# EAGLE design board_ätzen (EAGLE 6.5.0)
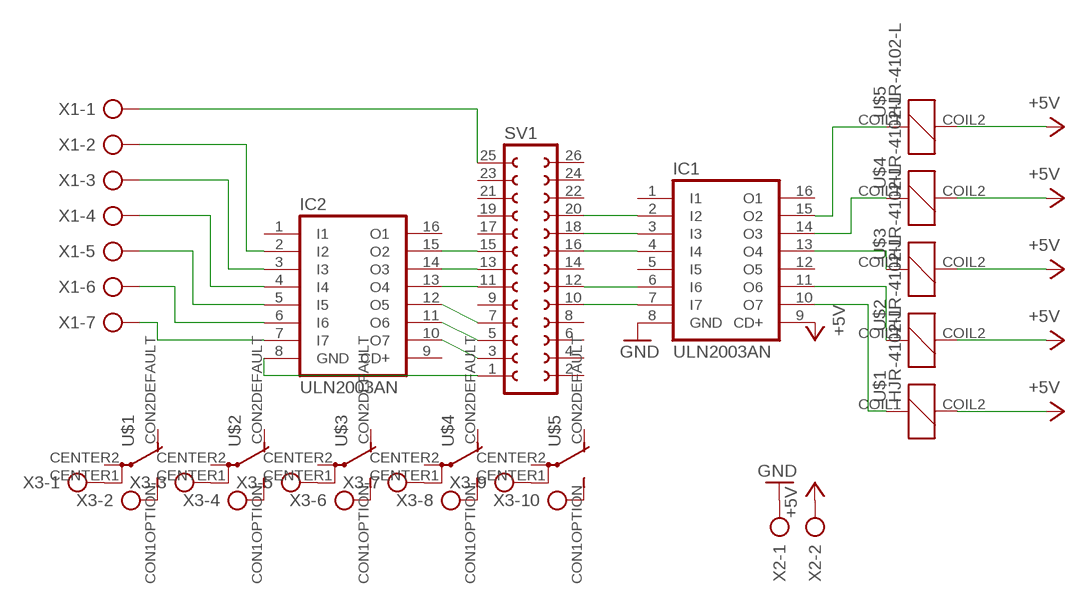
[diagram p0: schematic, sheet 1]

## Parts
IC1  ULN2003AN  [DIL16]
IC2  ULN2003AN  [DIL16]
SV1  FE13-2  [FE13-2]
U$1  HJR-4102-L  [HJR4102]
U$2  HJR-4102-L  [HJR4102]
U$3  HJR-4102-L  [HJR4102]
U$4  HJR-4102-L  [HJR4102]
U$5  HJR-4102-L  [HJR4102]
X1  AK500/7  [AK500/7]
X2  AK500/2  [AK500/2]
X3  AK500/10  [AK500/10]

## Nets
+5V: IC1.9(CD+) U$1.COIL2 U$2.COIL2 U$3.COIL2 U$4.COIL2 U$5.COIL2 X2.2
GND: IC1.8(GND) X2.1
N$1: IC2.8(GND) SV1.1
N$2: IC2.10(O7) SV1.3
N$3: IC2.11(O6) SV1.5
N$4: IC2.12(O5) SV1.7
N$5: IC2.13(O4) SV1.11
N$6: IC2.14(O3) SV1.13
N$7: IC2.15(O2) SV1.15
N$8: SV1.25 X1.1
N$9: IC2.2(I2) X1.2
N$10: IC2.3(I3) X1.3
N$11: IC2.4(I4) X1.4
N$12: IC2.5(I5) X1.5
N$13: IC2.6(I6) X1.6
N$14: IC2.7(I7) X1.7
N$15: IC1.7(I7) SV1.10
N$16: IC1.6(I6) SV1.12
N$17: IC1.2(I2) SV1.20
N$18: IC1.4(I4) SV1.16
N$19: IC1.15(O2) U$5.COIL1
N$20: IC1.14(O3) U$4.COIL1
N$21: IC1.13(O4) U$3.COIL1
N$22: U$4.CENTER1(P) X3.7
N$23: U$3.CON1OPTION(S) X3.6
N$24: IC1.11(O6) U$2.COIL1
N$25: U$5.CENTER1(P) X3.9
N$26: U$4.CON1OPTION(S) X3.8
N$27: U$3.CENTER1(P) X3.5
N$28: U$2.CON1OPTION(S) X3.4
N$29: IC1.3(I3) SV1.18
N$30: IC1.10(O7) U$1.COIL1
N$31: U$2.CENTER1(P) X3.3
N$32: U$1.CON1OPTION(S) X3.2
N$33: U$1.CENTER1(P) X3.1
N$34: U$5.CON1OPTION(S) X3.10
Unconnected: IC1.1(I1) IC1.5(I5) IC1.12(O5) IC1.16(O1) IC2.1(I1) IC2.9(CD+) IC2.16(O1) SV1.2 SV1.4 SV1.6 SV1.8 SV1.9 SV1.14 SV1.17 SV1.19 SV1.21 SV1.22 SV1.23 SV1.24 SV1.26 U$1.CENTER2(P) U$1.CON2DEFAULT(O) U$2.CENTER2(P) U$2.CON2DEFAULT(O) U$3.CENTER2(P) U$3.CON2DEFAULT(O) U$4.CENTER2(P) U$4.CON2DEFAULT(O) U$5.CENTER2(P) U$5.CON2DEFAULT(O)

## Library data of the parts
IC1 IC2 = uln-udn:ULN2003A: DRIVER ARRAY
SV1 = con-lsta:FE13-2: FEMALE HEADER; OC_FARNELL: unknown; OC_NEWARK: unknown
U$1-U$5 = relay:HJR-4102-L
X1 = con-ptr500:AK500/7: CONNECTOR; OC_FARNELL: unknown; OC_NEWARK: unknown
X2 = con-ptr500:AK500/2: CONNECTOR; OC_FARNELL: unknown; OC_NEWARK: unknown
X3 = con-ptr500:AK500/10: CONNECTOR; OC_FARNELL: unknown; OC_NEWARK: unknown

## Board
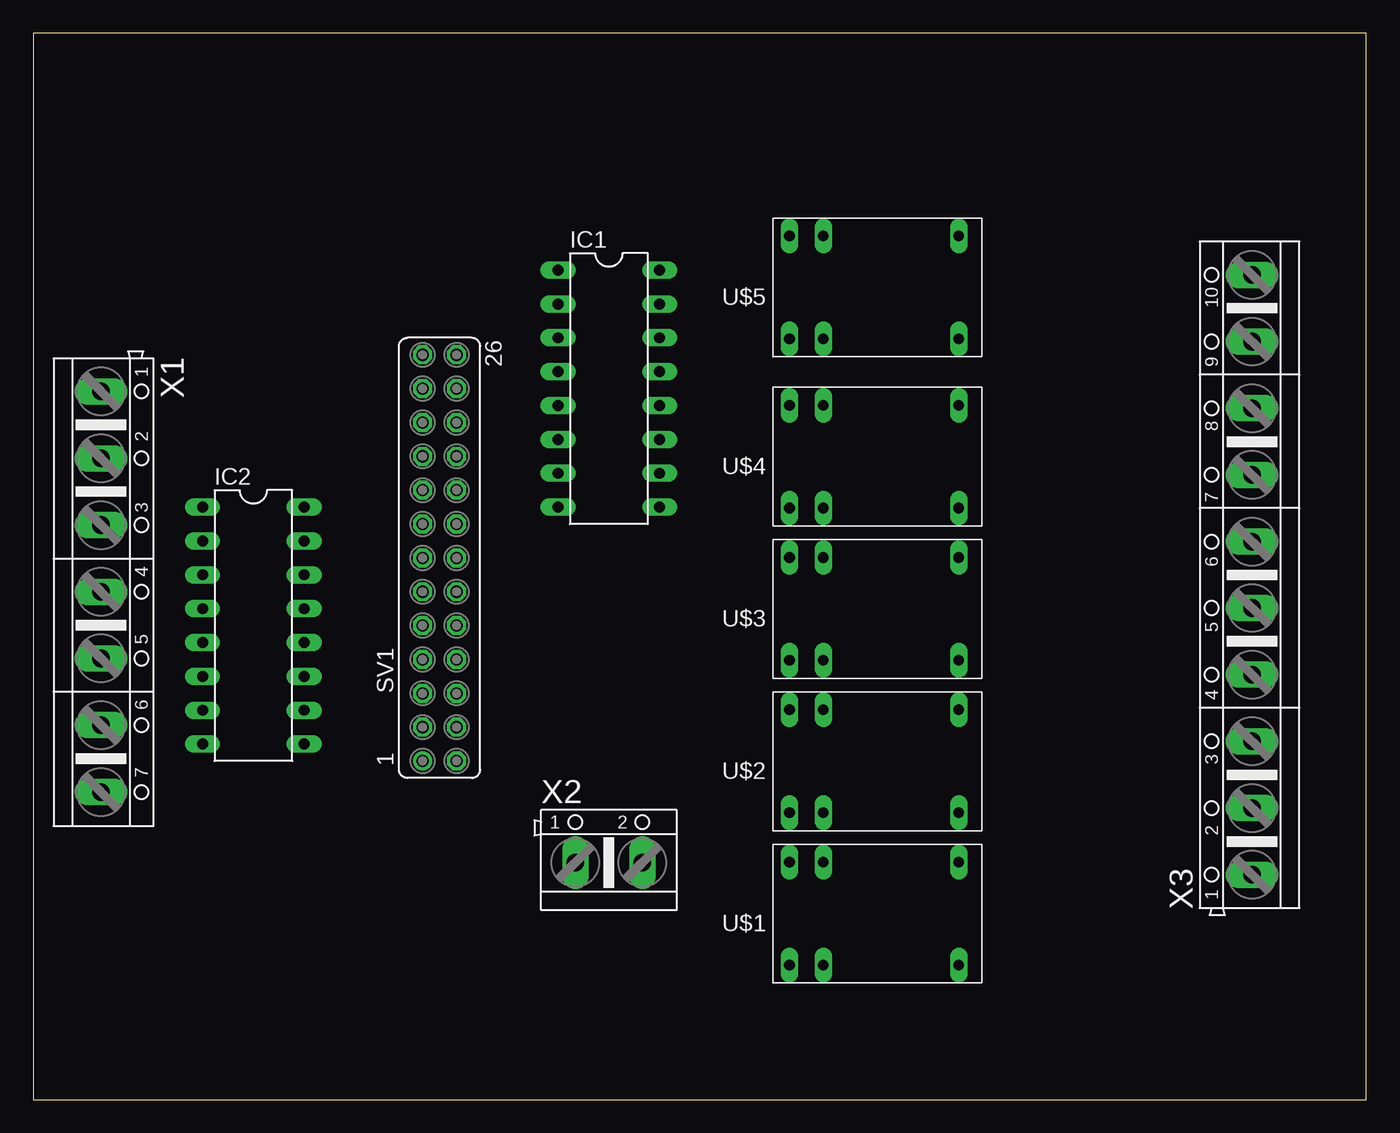
[diagram p1: board, top side]
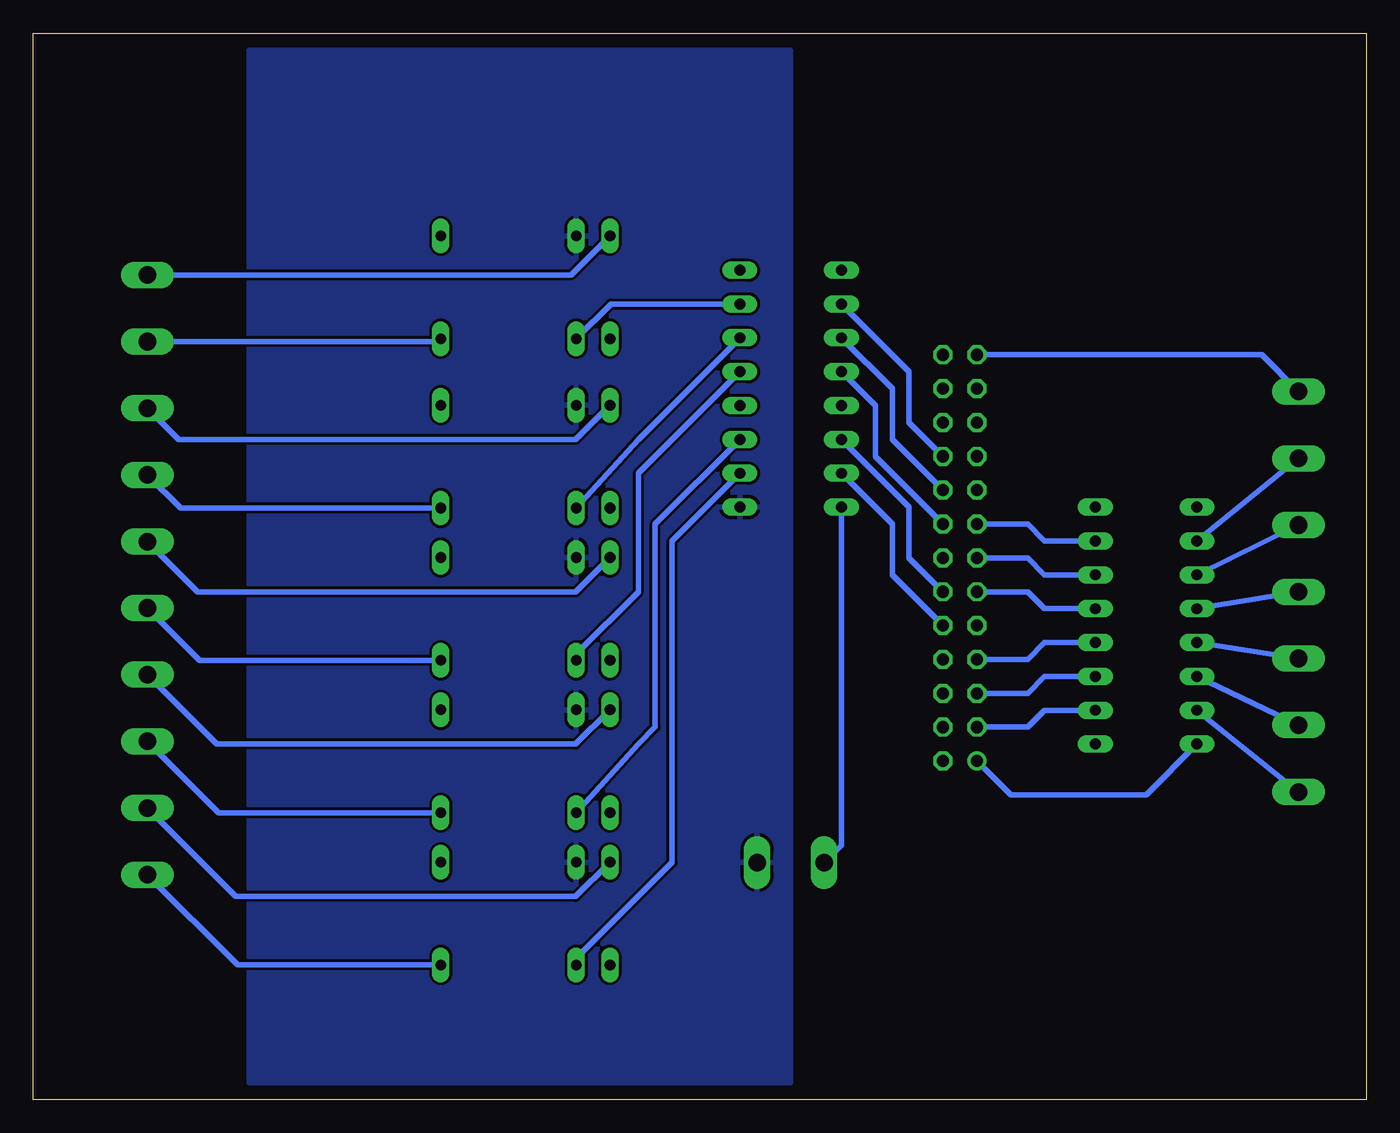
[diagram p2: board, bottom side, seen from below]

Size 100 x 80 mm. Coordinates in mm from the lower left corner, seen from the top.
Outline: 0,0 100,0 100,80 0,80 0,0
Copper layers (1*16): Top 0.035mm / dielectric 1.5mm / Bottom 0.035mm
Design rules "default": minimum track width 10mil, minimum drill 24mil, track to track 8mil, track to pad 8mil, pad to pad 8mil, via to via 8mil, smd to smd 8mil, copper to edge 40mil, drill to drill 8mil, minimum pad ring 10mil, minimum via ring 8mil, stop-mask expansion 4mil, vias tented up to drill 0mil, thermal gap 10mil

### Footprints (pad centres in the part's own frame; a part is rotated, then mirrored left to right if it is on the bottom)
DIL16 = drill 0.813 long: 1 -8.89,-3.81; 2 -6.35,-3.81; 3 -3.81,-3.81; 4 -1.27,-3.81; 5 1.27,-3.81; 6 3.81,-3.81; 7 6.35,-3.81; 8 8.89,-3.81; 9 8.89,3.81; 10 6.35,3.81; 11 3.81,3.81; 12 1.27,3.81; 13 -1.27,3.81; 14 -3.81,3.81; 15 -6.35,3.81; 16 -8.89,3.81
FE13-2 = drill 0.914: 1 -15.24,1.27 | drill 0.914 octagon: 2 -15.24,-1.27; 3 -12.7,1.27; 4 -12.7,-1.27; 5 -10.16,1.27; 6 -10.16,-1.27; 7 -7.62,1.27; 8 -7.62,-1.27; 9 -5.08,1.27; 10 -5.08,-1.27; 11 -2.54,1.27; 12 -2.54,-1.27; 13 0,1.27; 14 0,-1.27; 15 2.54,1.27; 16 2.54,-1.27; 17 5.08,1.27; 18 5.08,-1.27; 19 7.62,1.27; 20 7.62,-1.27; 21 10.16,1.27; 22 10.16,-1.27; 23 12.7,1.27; 24 12.7,-1.27; 25 15.24,1.27; 26 15.24,-1.27
HJR4102 = drill 0.8 long: CENTER1 -5.933,3.877; CENTER2 -5.933,-3.839; COIL1 4.227,3.877; COIL2 4.227,-3.839; CON1OPTION 6.767,-3.839; CON2DEFAULT 6.767,3.877
AK500/7 = drill 1.321 long: 1 -15.037,0; 2 -10.008,0; 3 -5.004,0; 4 0,0; 5 5.004,0; 6 10.008,0; 7 15.037,0
AK500/2 = drill 1.321 long: 1 -2.515,0; 2 2.515,0
AK500/10 = drill 1.321 long: 1 -22.504,0; 2 -17.501,0; 3 -12.497,0; 4 -7.493,0; 5 -2.489,0; 6 2.489,0; 7 7.493,0; 8 12.497,0; 9 17.501,0; 10 22.504,0

### Placement (x,y rotation side)
IC1  43.18,53.34 270 top
IC2  16.51,35.56 270 top
SV1  30.48,40.64 90 top
U$1  63.5,13.97 180 top
U$2  63.5,25.4 180 top
U$3  63.5,36.83 180 top
U$4  63.5,48.26 180 top
U$5  63.5,60.96 180 top
X1  5.08,38.1 270 top
X2  43.18,17.78 0 top
X3  91.44,39.37 90 top

### Tracks (layer width: path | path; a pad name or v marks a point on that pad's centre or on a via)
+5V
  pour Bottom: 43.18,41.91 43.18,78.74 83.82,78.74 83.82,1.27 43.18,1.27
GND
  Bottom 0.406: X2.1 39.37,19.07 IC1.8
N$1
  Bottom 0.406: SV1.1 26.67,22.86 16.51,22.86 IC2.8
N$2
  Bottom 0.406: SV1.3 25.4,27.94 24.13,29.21 IC2.10
N$3
  Bottom 0.406: SV1.5 25.4,30.48 24.13,31.75 IC2.11
N$4
  Bottom 0.406: IC2.12 24.13,34.29 25.4,33.02 SV1.7
N$5
  Bottom 0.406: IC2.13 24.13,36.83 25.4,38.1 SV1.11
N$6
  Bottom 0.406: SV1.13 25.4,40.64 24.13,39.37 IC2.14
N$7
  Bottom 0.406: SV1.15 25.4,43.18 24.13,41.91 IC2.15
N$8
  Bottom 0.406: SV1.25 7.82,55.88 X1.1
N$9
  Bottom 0.406: X1.2 IC2.2
N$10
  Bottom 0.406: X1.3 IC2.3
N$11
  Bottom 0.406: X1.4 IC2.4
N$12
  Bottom 0.406: X1.5 IC2.5
N$13
  Bottom 0.406: X1.6 IC2.6
N$14
  Bottom 0.406: X1.7 IC2.7
N$15
  Bottom 0.406: IC1.7 35.56,43.18 35.56,39.37 SV1.10
N$16
  Bottom 0.406: IC1.6 34.29,44.45 34.29,40.64 SV1.12
N$17
  Bottom 0.406: IC1.2 34.29,54.61 34.29,50.8 SV1.20
N$18
  Bottom 0.406: IC1.4 36.83,52.07 36.83,48.26 SV1.16
N$19
  Bottom 0.406: U$5.COIL1 56.67,59.69 IC1.15
N$20
  Bottom 0.406: U$4.COIL1 54.61,49.53 IC1.14
N$21
  Bottom 0.406: U$3.COIL1 59.27,33.44 54.61,38.1 54.61,46.99 IC1.13
N$22
  Bottom 0.406: U$4.CENTER1 88.96,44.38 X3.7
N$23
  Bottom 0.406: U$3.CON1OPTION 59.3,38.1 87.68,38.1 X3.6
N$24
  Bottom 0.406: U$2.COIL1 54.61,26.67 53.34,27.94 53.34,43.18 IC1.11
N$25
  Bottom 0.406: U$5.CENTER1 69.64,56.87 X3.9
N$26
  Bottom 0.406: U$4.CON1OPTION 59.3,49.53 89.1,49.53 X3.8
N$27
  Bottom 0.406: U$3.CENTER1 87.51,32.95 X3.5
N$28
  Bottom 0.406: U$2.CON1OPTION 59.3,26.67 86.23,26.67 X3.4
N$29
  Bottom 0.406: IC1.3 35.56,53.34 35.56,49.53 SV1.18
N$30
  Bottom 0.406: U$1.COIL1 59.27,10.58 52.07,17.78 52.07,41.91 IC1.10
N$31
  Bottom 0.406: U$2.CENTER1 86.09,21.52 X3.3
N$32
  Bottom 0.406: U$1.CON1OPTION 59.3,15.24 84.81,15.24 X3.2
N$33
  Bottom 0.406: U$1.CENTER1 84.67,10.09 X3.1
N$34
  Bottom 0.406: U$5.CON1OPTION 59.66,61.87 X3.10